# Altium schematic sheet BoardConnectors.SchDoc
size A4; Date: 07.06.2021; Author: Mateusz Mróz; CompanyName: AGH; DocumentNumber: 6; SheetNumber: 6; SheetTotal: 6
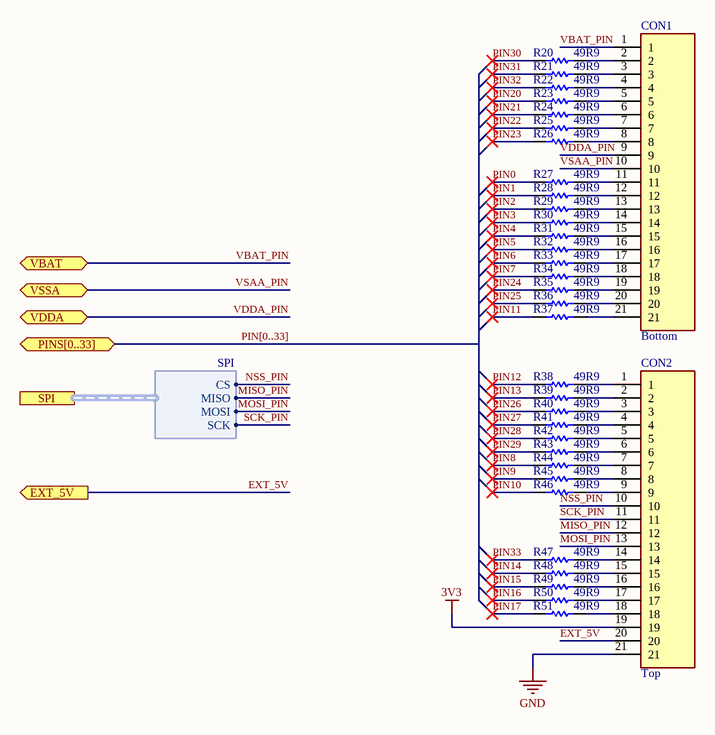
[diagram p0: BoardConnectors.SchDoc]

## Parts
CON1  Location: Bottom  [HDR_1X21_2.54]  (hidden comment: Header 21)
CON2  Location: Top  [HDR_1X21_2.54]  (hidden comment: Header 21)
R20  49R9  [Res_0603_MD]
R21  49R9  [Res_0603_MD]
R22  49R9  [Res_0603_MD]
R23  49R9  [Res_0603_MD]
R24  49R9  [Res_0603_MD]
R25  49R9  [Res_0603_MD]
R26  49R9  [Res_0603_MD]
R27  49R9  [Res_0603_MD]
R28  49R9  [Res_0603_MD]
R29  49R9  [Res_0603_MD]
R30  49R9  [Res_0603_MD]
R31  49R9  [Res_0603_MD]
R32  49R9  [Res_0603_MD]
R33  49R9  [Res_0603_MD]
R34  49R9  [Res_0603_MD]
R35  49R9  [Res_0603_MD]
R36  49R9  [Res_0603_MD]
R37  49R9  [Res_0603_MD]
R38  49R9  [Res_0603_MD]
R39  49R9  [Res_0603_MD]
R40  49R9  [Res_0603_MD]
R41  49R9  [Res_0603_MD]
R42  49R9  [Res_0603_MD]
R43  49R9  [Res_0603_MD]
R44  49R9  [Res_0603_MD]
R45  49R9  [Res_0603_MD]
R46  49R9  [Res_0603_MD]
R47  49R9  [Res_0603_MD]
R48  49R9  [Res_0603_MD]
R49  49R9  [Res_0603_MD]
R50  49R9  [Res_0603_MD]
R51  49R9  [Res_0603_MD]

## Ports
EXT_5V (out), PINS[0..33] (bidir), SPI (harness SPI), VBAT (bidir), VDDA (bidir), VSSA (bidir)

## Harnesses
SPI: CS, MISO, MOSI, SCK

## Nets
3V3: CON2.19
GND: CON2.21
EXT_5V: CON2.20 ; port EXT_5V
MISO_PIN: CON2.12 ; port SPI.MISO
MOSI_PIN: CON2.13 ; port SPI.MOSI
NSS_PIN: CON2.10 ; port SPI.CS
PIN0: R27.1
PIN1: R28.1
PIN2: R29.1
PIN3: R30.1
PIN4: R31.1
PIN5: R32.1
PIN6: R33.1
PIN7: R34.1
PIN8: R44.1
PIN9: R45.1
PIN10: R46.1
PIN11: R37.1
PIN12: R38.1
PIN13: R39.1
PIN14: R48.1
PIN15: R49.1
PIN16: R50.1
PIN17: R51.1
PIN20: R23.1
PIN21: R24.1
PIN22: R25.1
PIN23: R26.1
PIN24: R35.1
PIN25: R36.1
PIN26: R40.1
PIN27: R41.1
PIN28: R42.1
PIN29: R43.1
PIN30: R20.1
PIN31: R21.1
PIN32: R22.1
PIN33: R47.1
SCK_PIN: CON2.11 ; port SPI.SCK
VBAT_PIN: CON1.1 ; port VBAT
VDDA_PIN: CON1.9 ; port VDDA
VSAA_PIN: CON1.10 ; port VSSA
NetCON1_2: CON1.2 R20.2
NetCON1_3: CON1.3 R21.2
NetCON1_4: CON1.4 R22.2
NetCON1_5: CON1.5 R23.2
NetCON1_6: CON1.6 R24.2
NetCON1_7: CON1.7 R25.2
NetCON1_8: CON1.8 R26.2
NetCON1_11: CON1.11 R27.2
NetCON1_12: CON1.12 R28.2
NetCON1_13: CON1.13 R29.2
NetCON1_14: CON1.14 R30.2
NetCON1_15: CON1.15 R31.2
NetCON1_16: CON1.16 R32.2
NetCON1_17: CON1.17 R33.2
NetCON1_18: CON1.18 R34.2
NetCON1_19: CON1.19 R35.2
NetCON1_20: CON1.20 R36.2
NetCON1_21: CON1.21 R37.2
NetCON2_1: CON2.1 R38.2
NetCON2_2: CON2.2 R39.2
NetCON2_3: CON2.3 R40.2
NetCON2_4: CON2.4 R41.2
NetCON2_5: CON2.5 R42.2
NetCON2_6: CON2.6 R43.2
NetCON2_7: CON2.7 R44.2
NetCON2_8: CON2.8 R45.2
NetCON2_9: CON2.9 R46.2
NetCON2_14: CON2.14 R47.2
NetCON2_15: CON2.15 R48.2
NetCON2_16: CON2.16 R49.2
NetCON2_17: CON2.17 R50.2
NetCON2_18: CON2.18 R51.2

## Buses and harness runs
bus PIN[0..33] = port PINS[0..33]

## Notes on the sheet
- University name:
- Degree course:
- 3th year electronics
- Date:
- Author:
- Student Index:
- Course:
- Checked by:
- PUE
- dr hab. inż. Cezary Worek, prof. AGH
- 305093
- Project name:
- Document name:
- Variant name:
- Sheet/all:
- /
- Version number:

## Library data of the parts
CON1 CON2 = Header 21: Connector; Manufacturer_Name: Amphenol; MPN: 68001-121HLF; Datasheet Link: http://docs-emea.rs-online.com/webdocs/1450/0900766b81450c45.pdf; Height: 8.58mm; Mouser Part Number: 649-68001-121HLF; Mouser Price/Stock: https://www.mouser.co.uk/ProductDetail/Amphenol-FCI/68001-121HLF/?qs=QKvFUfBIyQK%252BoxmWjqVzjQ%3D%3D; Arrow Part Number: 68001-121HLF; Arrow Price/Stock: https://www.arrow.com/en/products/68001-121hlf/amphenol-fci; System: Connector
R20-R51 = Resistor: MPN: CRCW060349R9FKEA; Value: 49R9; Package: 0603